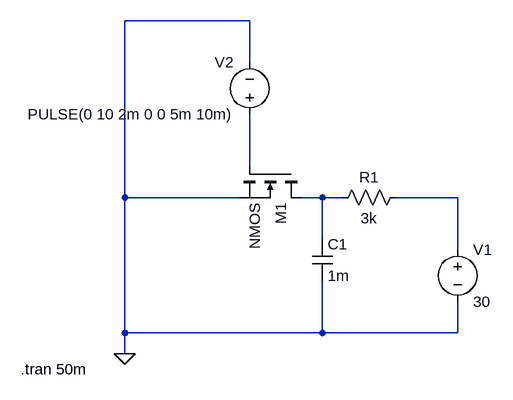
[diagram p0: schematic pnp_v4.asc]
pnp_v4.asc, the LTspice schematic file:
Version 4.1
SHEET 1 880 680
WIRE 144 -208 -48 -208
WIRE 144 -144 144 -208
WIRE 144 16 144 -64
WIRE -48 64 -48 -208
WIRE 128 64 -48 64
WIRE 256 64 224 64
WIRE 288 64 256 64
WIRE 464 64 368 64
WIRE 256 128 256 64
WIRE 464 144 464 64
WIRE -48 272 -48 64
WIRE 256 272 256 192
WIRE 256 272 -48 272
WIRE 464 272 464 224
WIRE 464 272 256 272
WIRE -48 304 -48 272
FLAG -48 304 0
SYMBOL voltage 144 -48 R180
WINDOW 0 24 96 Left 2
WINDOW 3 24 16 Left 2
WINDOW 123 0 0 Left 0
WINDOW 39 0 0 Left 0
SYMATTR InstName V2
SYMATTR Value PULSE(0 10 2m 0 0 5m 10m)
SYMBOL nmos 224 16 R90
SYMATTR InstName M1
SYMBOL voltage 464 128 R0
WINDOW 123 0 0 Left 0
WINDOW 39 0 0 Left 0
SYMATTR InstName V1
SYMATTR Value 30
SYMBOL res 384 48 R90
WINDOW 0 0 56 VBottom 2
WINDOW 3 32 56 VTop 2
SYMATTR InstName R1
SYMATTR Value 3k
SYMBOL cap 240 128 R0
SYMATTR InstName C1
SYMATTR Value 1m
TEXT -208 328 Left 2 !.tran 50m

The netlist it stands for:
* pnp_v4.asc
V2 N001 0 PULSE(0 10 2m 0 0 5m 10m)
M1 N002 N001 0 0 NMOS
V1 N003 0 30
R1 N003 N002 3k
C1 N002 0 1m
.model NMOS NMOS
.model PMOS PMOS
.lib standard.mos
.tran 50m
.backanno
.end